# Altium schematic sheet Microcontroller.SchDoc
size A
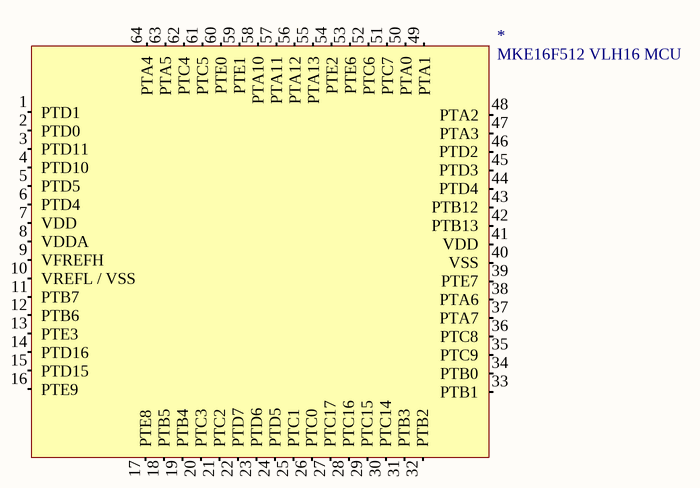
[diagram p0: Microcontroller.SchDoc]

## Parts
*  MKE16F512 VLH16 MCU  [TQFP64]

## Nets

Not connected (* = marked no-connect by the designer): * 1(PTD1) 2(PTD0) 3(PTD11) 4(PTD10) 5(PTD5) 6(PTD4) 7(VDD) 8(VDDA) 9(VFREFH) 10(VREFL_/_VSS) 11(PTB7) 12(PTB6) 13(PTE3) 14(PTD16) 15(PTD15) 16(PTE9) 17(PTE8) 18(PTB5) 19(PTB4) 20(PTC3) 21(PTC2) 22(PTD7) 23(PTD6) 24(PTD5) 25(PTC1) 26(PTC0) 27(PTC17) 28(PTC16) 29(PTC15) 30(PTC14) 31(PTB3) 32(PTB2) 33(PTB1) 34(PTB0) 35(PTC9) 36(PTC8) 37(PTA7) 38(PTA6) 39(PTE7) 40(VSS) 41(VDD) 42(PTB13) 43(PTB12) 44(PTD4) 45(PTD3) 46(PTD2) 47(PTA3) 48(PTA2) 49(PTA1) 50(PTA0) 51(PTC7) 52(PTC6) 53(PTE6) 54(PTE2) 55(PTA13) 56(PTA12) 57(PTA11) 58(PTA10) 59(PTE1) 60(PTE0) 61(PTC5) 62(PTC4) 63(PTA5) 64(PTA4)

## Library data of the parts
* = 1: idMCU: 1